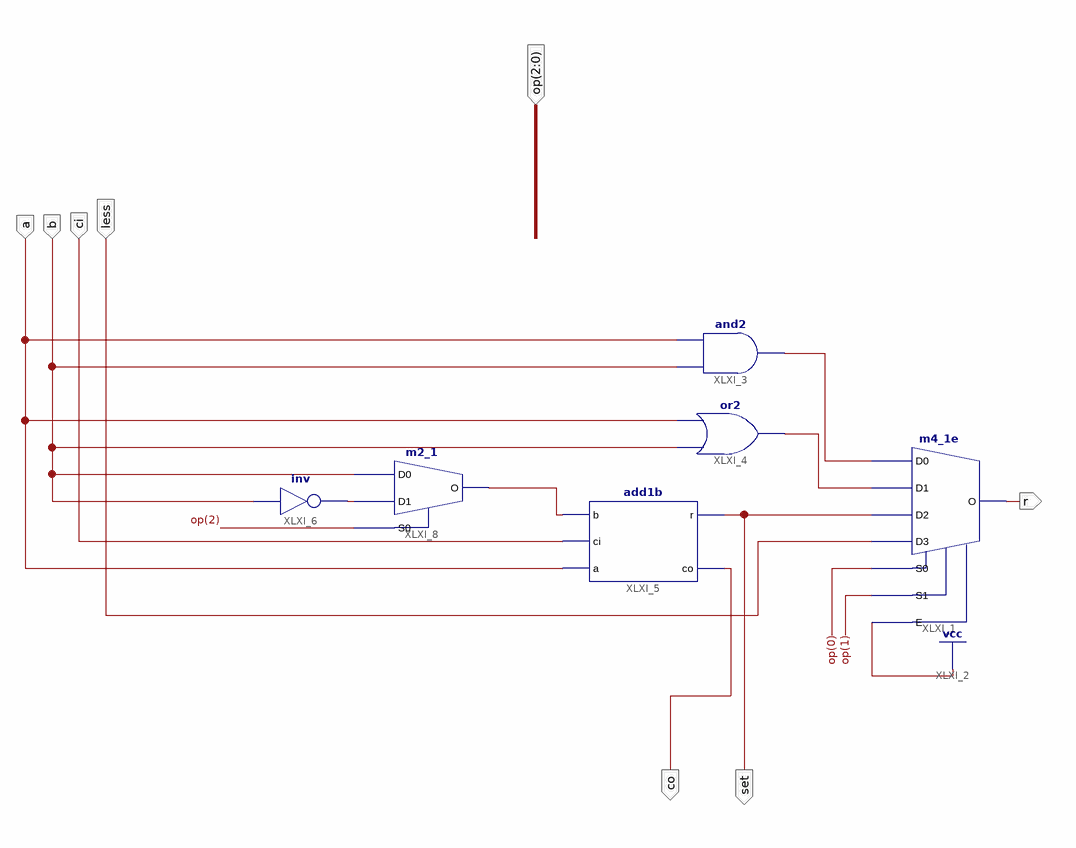
[diagram p0: schematic sheet 1]
// Xilinx ISE schematic alu_1b.sch (spartan3e) as structural Verilog: 6 symbols, 8 ports
module alu_1b (
  input  b,
  input  a,
  input  [2:0] op,
  input  ci,
  input  less,
  output r,
  output co,
  output set
);

  wire XLXN_3, XLXN_4, XLXN_9, XLXN_10;

  m4_1e XLXI_1 (.D0(XLXN_3), .D1(XLXN_4), .D2(set), .D3(less), .E(1'b1), .S0(op[0]), .S1(op[1]), .O(r));
  and XLXI_3 (XLXN_3, b, a);
  or XLXI_4 (XLXN_4, b, a);
  add1b XLXI_5 (.b(XLXN_10), .ci(ci), .a(a), .r(set), .co(co));
  not XLXI_6 (XLXN_9, b);
  m2_1 XLXI_8 (.D0(b), .D1(XLXN_9), .S0(op[2]), .O(XLXN_10));
endmodule
